# EAGLE design watchclock (EAGLE 7.2.0)
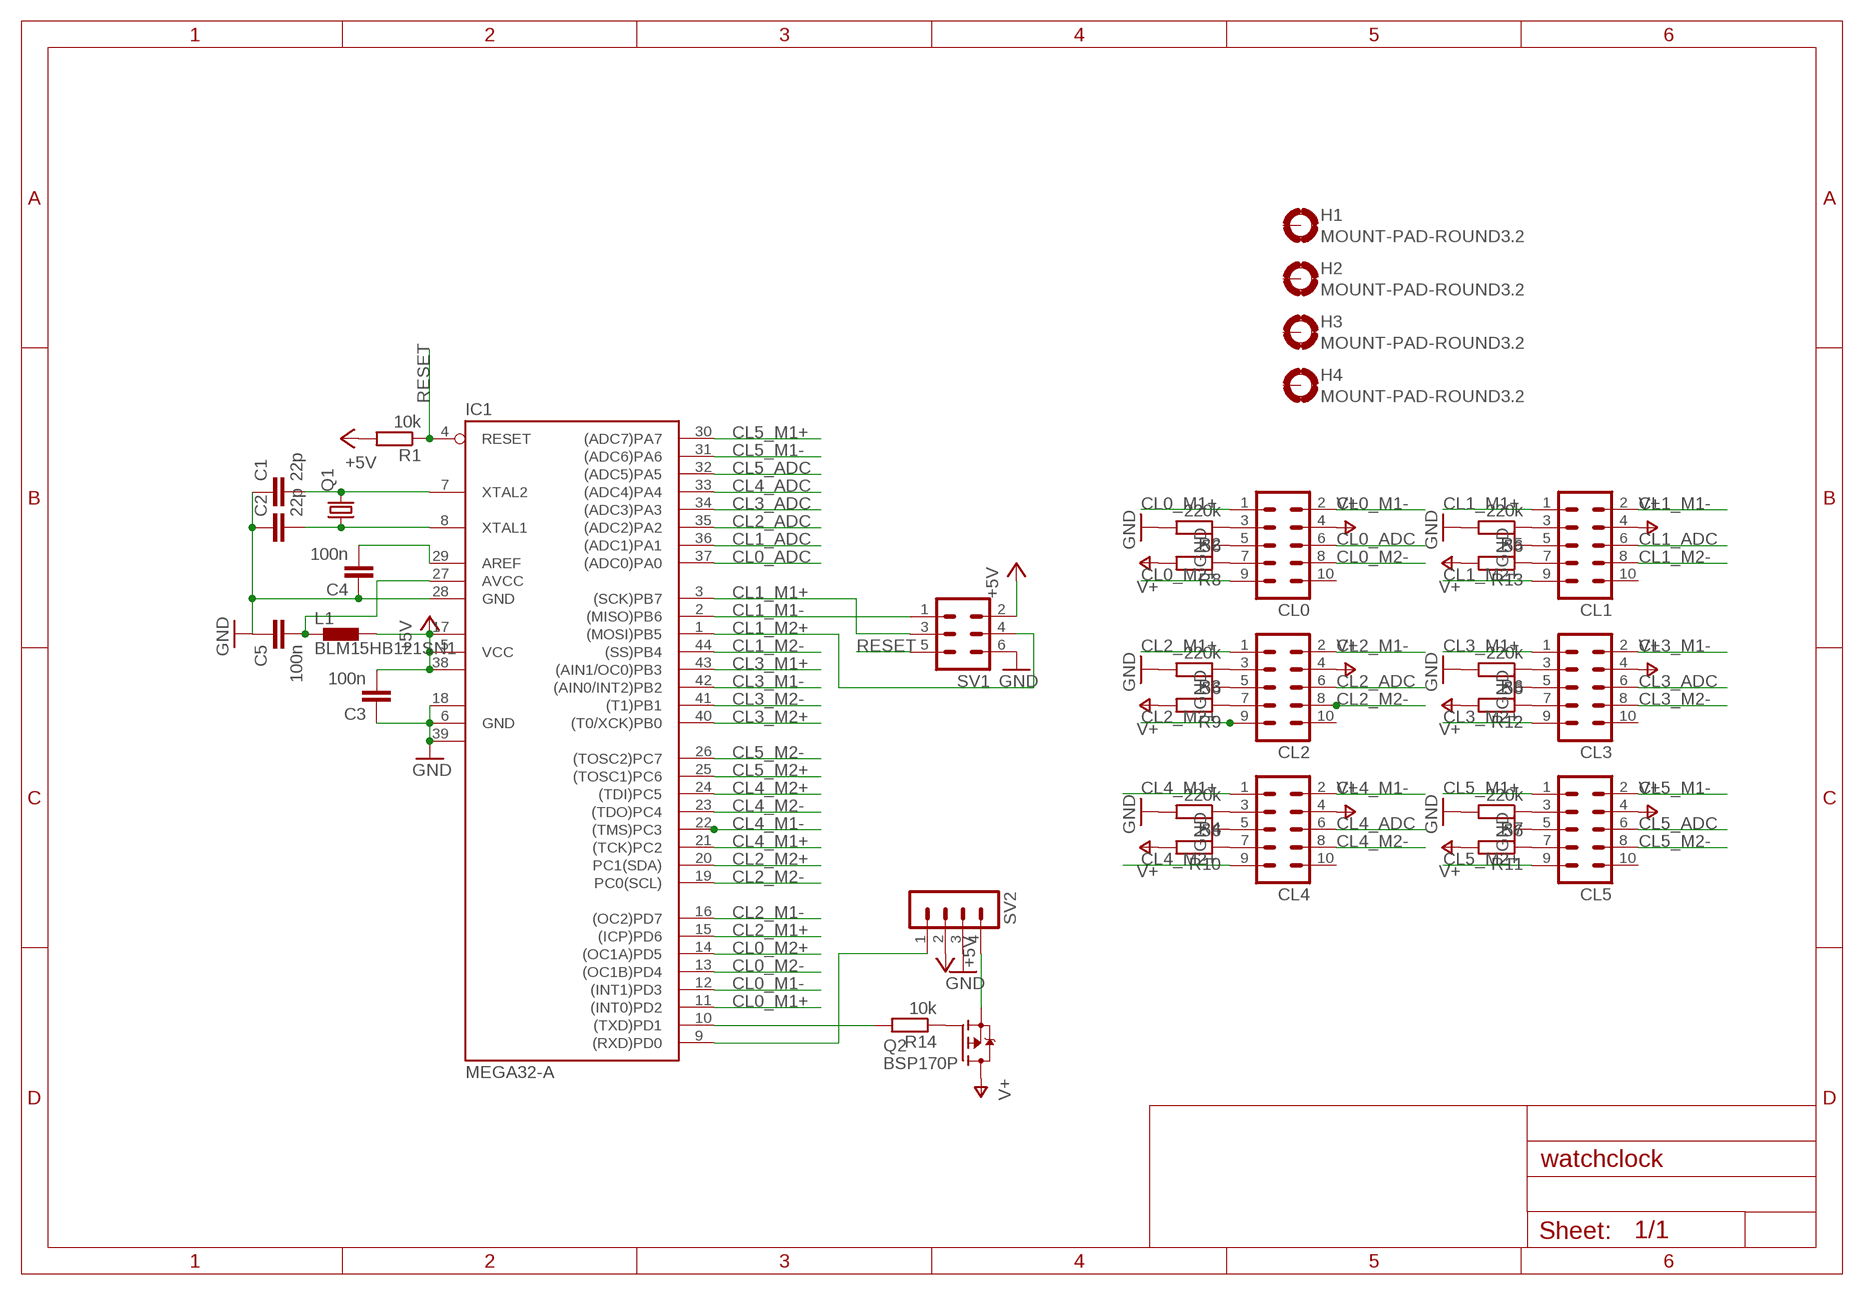
[diagram p0: schematic, sheet 1]

## Parts
C1  22p  C-EUC0805  [C0805]
C2  22p  C-EUC0805  [C0805]
C3  100n  C-EUC0805  [C0805]
C4  100n  C-EUC0805  [C0805]
C5  100n  C-EUC0805  [C0805]
CL0  ML10  [ML10]
CL1  ML10  [ML10]
CL2  ML10  [ML10]
CL3  ML10  [ML10]
CL4  ML10  [ML10]
CL5  ML10  [ML10]
H1  MOUNT-PAD-ROUND3.2  [3,2-PAD]
H2  MOUNT-PAD-ROUND3.2  [3,2-PAD]
H3  MOUNT-PAD-ROUND3.2  [3,2-PAD]
H4  MOUNT-PAD-ROUND3.2  [3,2-PAD]
IC1  MEGA32-A  [TQFP44]
L1  BLM15HB121SN1  [0402]
Q1  CRYSTALHC49S  [HC49/S]
Q2  BSP170P  [SOT223]
R1  10k  R-EU_M0805  [M0805]
R2  220k  R-EU_M0805  [M0805]
R3  220k  R-EU_M0805  [M0805]
R4  220k  R-EU_M0805  [M0805]
R5  220k  R-EU_M0805  [M0805]
R6  220k  R-EU_M0805  [M0805]
R7  220k  R-EU_M0805  [M0805]
R8  56  R-EU_M0805  [M0805]
R9  56  R-EU_M0805  [M0805]
R10  56  R-EU_M0805  [M0805]
R11  56  R-EU_M0805  [M0805]
R12  56  R-EU_M0805  [M0805]
R13  56  R-EU_M0805  [M0805]
R14  10k  R-EU_M0805  [M0805]
SV1  ML6  [ML6]
SV2  MA04-1  [MA04-1]

## Nets
+5V: C3.2 IC1.5(VCC) IC1.17(VCC1) IC1.38(VCC2) L1.2 R1.2 SV1.2 SV2.2
CL0_ADC: CL0.6 IC1.37((ADC0)PA0)
CL0_M1+: CL0.1 IC1.11((INT0)PD2)
CL0_M1-: CL0.2 IC1.12((INT1)PD3)
CL0_M2+: CL0.9 IC1.14((OC1A)PD5)
CL0_M2-: CL0.8 IC1.13((OC1B)PD4)
CL1_ADC: CL1.6 IC1.36((ADC1)PA1)
CL1_M1+: CL1.1 IC1.3((SCK)PB7) SV1.3
CL1_M1-: CL1.2 IC1.2((MISO)PB6) SV1.1
CL1_M2+: CL1.9 IC1.1((MOSI)PB5) SV1.4
CL1_M2-: CL1.8 IC1.44((SS)PB4)
CL2_ADC: CL2.6 IC1.35((ADC2)PA2)
CL2_M1+: CL2.1 IC1.15((ICP)PD6)
CL2_M1-: CL2.2 IC1.16((OC2)PD7)
CL2_M2+: CL2.9 IC1.20(PC1(SDA))
CL2_M2-: CL2.8 IC1.19(PC0(SCL))
CL3_ADC: CL3.6 IC1.34((ADC3)PA3)
CL3_M1+: CL3.1 IC1.43((AIN1/OC0)PB3)
CL3_M1-: CL3.2 IC1.42((AIN0/INT2)PB2)
CL3_M2+: CL3.9 IC1.40((T0/XCK)PB0)
CL3_M2-: CL3.8 IC1.41((T1)PB1)
CL4_ADC: CL4.6 IC1.33((ADC4)PA4)
CL4_M1+: CL4.1 IC1.21((TCK)PC2)
CL4_M1-: CL4.2 IC1.22((TMS)PC3)
CL4_M2+: CL4.9 IC1.24((TDI)PC5)
CL4_M2-: CL4.8 IC1.23((TDO)PC4)
CL5_ADC: CL5.6 IC1.32((ADC5)PA5)
CL5_M1+: CL5.1 IC1.30((ADC7)PA7)
CL5_M1-: CL5.2 IC1.31((ADC6)PA6)
CL5_M2+: CL5.9 IC1.25((TOSC1)PC6)
CL5_M2-: CL5.8 IC1.26((TOSC2)PC7)
GND: C1.1 C2.1 C3.1 C4.1 C5.1 CL0.5 CL1.5 CL2.5 CL3.5 CL4.5 CL5.5 IC1.6(GND) IC1.18(GND1) IC1.28(GND) IC1.39(GND2) R2.2 R3.2 R4.2 R5.2 R6.2 R7.2 SV1.6 SV2.3
N$1: CL0.3 R2.1
N$2: C2.2 IC1.8(XTAL1) Q1.1
N$3: C1.2 IC1.7(XTAL2) Q1.2
N$4: C4.2 IC1.29(AREF)
N$5: C5.2 IC1.27(AVCC) L1.1
N$6: CL2.3 R3.1
N$7: CL4.3 R4.1
N$8: CL1.3 R5.1
N$9: CL3.3 R6.1
N$10: CL5.3 R7.1
N$11: CL0.7 R8.1
N$12: CL2.7 R9.1
N$13: CL4.7 R10.1
N$14: CL5.7 R11.1
N$15: CL3.7 R12.1
N$16: CL1.7 R13.1
N$17: Q2.1(G) R14.1
N$18: Q2.3(S) SV2.4
N$26: IC1.10((TXD)PD1) R14.2
RESET: IC1.4(RESET) R1.1 SV1.5
RXT: IC1.9((RXD)PD0) SV2.1
V+: CL0.4 CL1.4 CL2.4 CL3.4 CL4.4 CL5.4 Q2.2(D) Q2.4(D) R8.2 R9.2 R10.2 R11.2 R12.2 R13.2
Unconnected: CL0.10 CL1.10 CL2.10 CL3.10 CL4.10 CL5.10 H1.B3,2(MOUNT) H2.B3,2(MOUNT) H3.B3,2(MOUNT) H4.B3,2(MOUNT)

## Library data of the parts
C1-C5 = resistor:C-EU: CAPACITOR, European symbol
CL0 CL1-CL5 = con-harting-ml:ML10: HARTING; OC_FARNELL: unknown; OC_NEWARK: unknown
H1-H4 = holes:MOUNT-PAD-ROUND: MOUNTING PAD, round
IC1 = atmel:MEGA32: MICROCONTROLLER 32 Kbytes FLASH 2 Kbytes SRAM 1 Kbytes EEPROM USART 8-channel 10 bit ADC Source: www.atmel.com .. doc2503.pdf; MPN: ATMEGA32-16AU; OC_FARNELL: 9171274; OC_NEWARK: 69K6677
L1 = inductors:BLM15H: EMIFIL (R) Chip Ferrite Bead for GHz Noise Source: http://www.murata.com/ Ferrite Bead BLM15H.pdf
Q1 = crystal:CRYSTAL: CRYSTAL; OC_FARNELL: 1667008; OC_NEWARK: unknown
Q2 = transistor-fet:BSP170P: SIPMOS(R) Small-Signal-Transistor P-Channel, Enhancement mode Source: http://www.infineon.com/upload/Document/BSP170P_Rev2.4.pdf
R1-R14 = resistor:R-EU_: RESISTOR, European symbol
SV1 = con-harting-ml:ML6: HARTING; OC_FARNELL: unknown; OC_NEWARK: unknown
SV2 = con-lstb:MA04-1: PIN HEADER; OC_FARNELL: unknown; OC_NEWARK: unknown

## Board
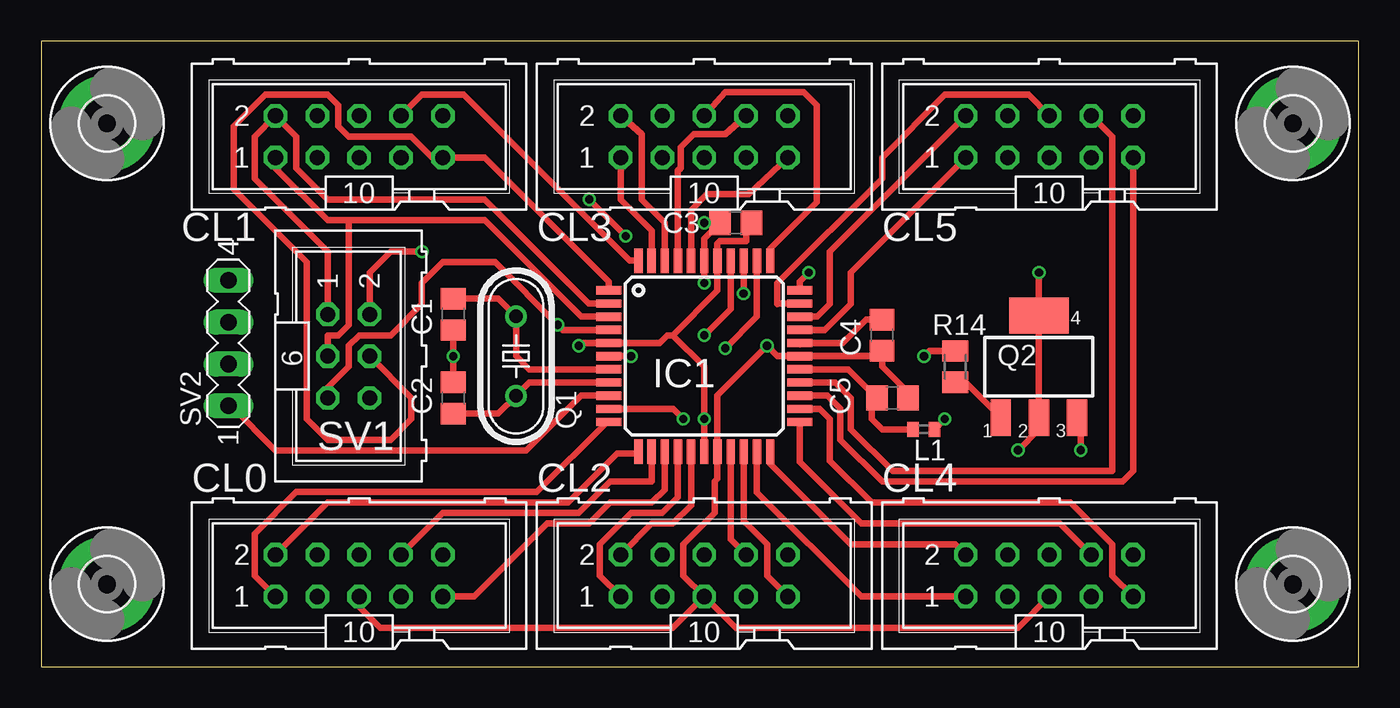
[diagram p1: board, top side]
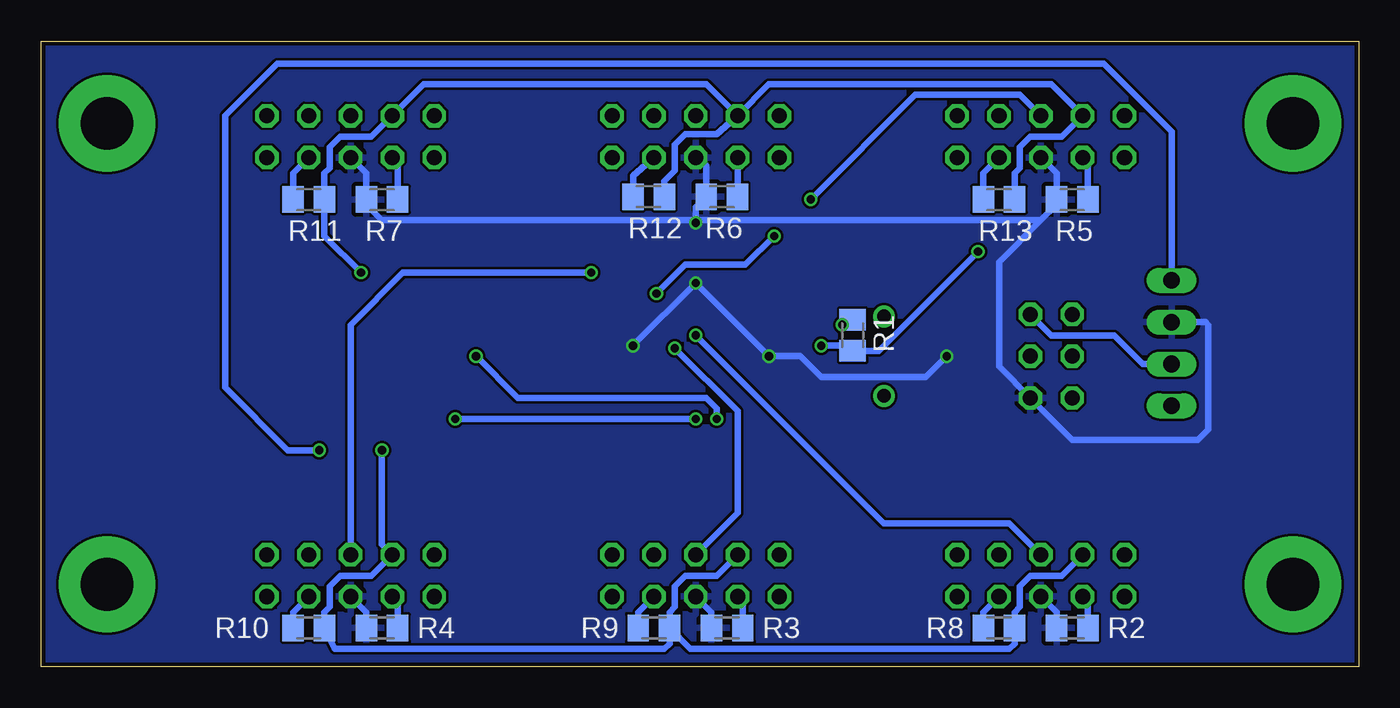
[diagram p2: board, bottom side, seen from below]

Size 80 x 38 mm. Coordinates in mm from the lower left corner, seen from the top.
Outline: 0,0 80,0 80,38 0,38 0,0
Copper layers (1*16): Top 0.035mm / dielectric 1.5mm / Bottom 0.035mm
Design rules "Elecrow_2-layer_eagle_rule": minimum track width 6mil, minimum drill 12mil, track to track 6mil, track to pad 6mil, pad to pad 6mil, via to via 6mil, smd to smd 0mil, copper to edge 10mil, drill to drill 10mil, minimum pad ring 10mil, minimum via ring 6mil, stop-mask expansion 2mil, vias tented up to drill 100mil, thermal gap 10mil

### Footprints (pad centres in the part's own frame; a part is rotated, then mirrored left to right if it is on the bottom)
C0805 = smd 1.3 x 1.5: 1 -0.95,0; 2 0.95,0
ML10 = drill 0.914 octagon: 1 -5.08,-1.27; 2 -5.08,1.27; 3 -2.54,-1.27; 4 -2.54,1.27; 5 0,-1.27; 6 0,1.27; 7 2.54,-1.27; 8 2.54,1.27; 9 5.08,-1.27; 10 5.08,1.27
3,2-PAD = drill 3.2 pad 5.842: B3,2 0,0
TQFP44 = smd 1.5 x 0.5: 1 -5.8,4; 2 -5.8,3.2; 3 -5.8,2.4; 4 -5.8,1.6; 5 -5.8,0.8; 6 -5.8,0; 7 -5.8,-0.8; 8 -5.8,-1.6; 9 -5.8,-2.4; 10 -5.8,-3.2; 11 -5.8,-4; 23 5.8,-4; 24 5.8,-3.2; 25 5.8,-2.4; 26 5.8,-1.6; 27 5.8,-0.8; 28 5.8,0; 29 5.8,0.8; 30 5.8,1.6; 31 5.8,2.4; 32 5.8,3.2; 33 5.8,4 | smd 0.5 x 1.5: 12 -4,-5.8; 13 -3.2,-5.8; 14 -2.4,-5.8; 15 -1.6,-5.8; 16 -0.8,-5.8; 17 0,-5.8; 18 0.8,-5.8; 19 1.6,-5.8; 20 2.4,-5.8; 21 3.2,-5.8; 22 4,-5.8; 34 4,5.8; 35 3.2,5.8; 36 2.4,5.8; 37 1.6,5.8; 38 0.8,5.8; 39 0,5.8; 40 -0.8,5.8; 41 -1.6,5.8; 42 -2.4,5.8; 43 -3.2,5.8; 44 -4,5.8
0402 = smd 0.7 x 0.9: 1 -0.65,0; 2 0.65,0
HC49/S = drill 0.813: 1 -2.413,0; 2 2.413,0
SOT223 = smd 1.219 x 2.235: 1 -2.311,-3.099; 2 0,-3.099; 3 2.311,-3.099 | smd 3.6 x 2.2: 4 0,3.099
M0805 = smd 1.3 x 1.6: 1 -0.95,0; 2 0.95,0
ML6 = drill 0.914 octagon: 1 -2.54,-1.27; 2 -2.54,1.27; 3 0,-1.27; 4 0,1.27; 5 2.54,-1.27; 6 2.54,1.27
MA04-1 = drill 1.016 long: 1 -3.81,0; 2 -1.27,0; 3 1.27,0; 4 3.81,0

### Placement (x,y rotation side)
C1  25.02,21.4 90 top
C2  25.02,16.32 270 top
C3  42.16,26.96 0 top
C4  51.05,20.13 90 top
C5  51.69,16.32 180 top
CL0  19.3,5.53 0 top
CL1  19.3,32.2 0 top
CL2  40.26,5.53 0 top
CL3  40.26,32.2 0 top
CL4  61.22,5.53 0 top
CL5  61.22,32.2 0 top
H1  4,5 0 top
H2  76,5 0 top
H3  4,33 0 top
H4  76,33 0 top
IC1  40.26,18.86 0 top
L1  53.59,14.41 0 top
Q1  28.83,18.86 90 top
Q2  60.58,18.23 0 top
R1  30.73,20.13 270 bottom
R2  17.4,2.35 180 bottom
R3  38.35,2.35 180 bottom
R4  59.31,2.35 180 bottom
R5  17.4,28.38 180 bottom
R6  38.67,28.54 180 bottom
R7  59.31,28.38 180 bottom
R8  21.84,2.35 0 bottom
R9  42.8,2.35 0 bottom
R10  63.75,2.35 0 bottom
R11  63.75,28.38 0 bottom
R12  43.12,28.54 0 bottom
R13  21.84,28.38 0 bottom
R14  55.5,18.23 90 top
SV1  18.67,18.86 270 top
SV2  11.37,19.65 90 top

### Tracks (layer width: path | path; a pad name or v marks a point on that pad's centre or on a via)
+5V  (via drill 0.5)
  Top 0.406: 38.35,20.13 41.06,22.84 IC1.38 41.06,25.69 41.21,25.84 42.8,25.84 42.8,26.64 C3.2 | 38.35,20.13 38.02,20.13 37.55,19.66 IC1.5 32.8,19.66 v32.64,19.5 | IC1.17 v40.26,15.05 40.26,18.23 38.35,20.13 | v54.87,15.05 54.87,15.04 L1.2 | v23.11,25.21 21.21,25.21 19.94,23.94 SV1.2
  Bottom 0.406: v40.26,15.05 v54.87,15.05 | v32.64,19.5 31.05,19.5 R1.2 29.15,19.18 v23.11,25.21 | SV2.2 13.11,18.38 14.86,20.13 18.67,20.13 SV1.2
CL0_ADC  (via drill 0.5)
  Top 0.406: IC1.37 41.86,21.73 v40.26,20.13
  Bottom 0.406: v40.26,20.13 28.83,8.7 21.21,8.7 CL0.6
CL0_M1+
  Top 0.406: IC1.11 34.35,14.86 30.1,10.61 15.5,10.61 12.95,8.06 12.95,5.53 CL0.1
CL0_M1-
  Top 0.406: CL0.2 17.4,9.97 32.01,9.97 34.99,12.95 36.26,12.95 IC1.12
CL0_M2+
  Top 0.406: CL0.9 26.29,4.26 30.73,8.7 33.27,8.7 34.55,9.97 37.09,9.97 37.86,10.74 IC1.14
CL0_M2-
  Top 0.406: CL0.8 24.38,9.34 32.64,9.34 34.55,11.24 37.09,11.24 37.06,11.27 IC1.13
CL1_ADC  (via drill 0.5)
  Top 0.406: v42.64,22.67 42.64,24.64 IC1.36 | v35.5,26.16 v33.27,28.38
  Bottom 0.406: v42.64,22.67 40.9,24.42 37.24,24.42 v35.5,26.16 | CL1.6 20.57,34.73 26.92,34.73 v33.27,28.38
CL1_M1+
  Top 0.406: IC1.3 32.78,21.26 26.92,27.11 18.67,27.11 | 18.67,27.11 17.4,27.11 14.23,30.29 CL1.1 | SV1.3 17.4,20.13 18.04,20.13 18.67,20.77 18.67,27.11
CL1_M1-
  Top 0.406: IC1.2 33.25,22.06 26.92,28.38 17.4,28.38 15.5,30.29 15.5,32.2 CL1.2 12.95,32.2 12.95,29.66 17.4,25.21 SV1.1
CL1_M2+
  Top 0.406: IC1.1 34.46,23.39 26.92,30.92 CL1.9 23.75,30.92 22.48,32.2 18.67,32.2 18.04,32.83 18.04,34.1 17.4,34.73 13.59,34.73 11.68,32.83 11.68,29.02 16.13,24.57 16.13,15.05 17.4,13.78 21.21,13.78 22.48,15.05 22.48,16.32 SV1.4
CL1_M2-
  Top 0.406: IC1.44 35.73,24.66 25.66,34.73 23.11,34.73 CL1.8
CL2_ADC  (via drill 0.5)
  Top 0.406: IC1.35 43.46,21.27 v41.53,19.34
  Bottom 0.406: CL2.6 37.72,9.34 37.72,15.53 v41.53,19.34
CL2_M1+
  Top 0.406: IC1.15 38.66,10.28 37.72,9.34 35.81,9.34 33.91,7.43 33.91,5.53 CL2.1
CL2_M1-
  Top 0.406: IC1.16 39.46,9.8 38.35,8.7 37.09,8.7 CL2.2
CL2_M2+
  Top 0.406: IC1.20 42.66,8.84 44.07,7.43 44.07,5.53 CL2.9
CL2_M2-
  Top 0.406: IC1.19 41.86,7.73 CL2.8
CL3_ADC
  Top 0.406: IC1.34 44.26,25.4 47.09,28.23 47.09,34.1 46.29,34.89 41.53,34.89 CL3.6
CL3_M1+
  Top 0.406: CL3.1 35.18,28.38 37.06,26.5 IC1.43
CL3_M1-
  Top 0.406: CL3.2 36.45,32.35 36.45,28.38 37.86,26.98 IC1.42
CL3_M2+
  Top 0.406: IC1.40 39.46,27.74 40.42,28.7 42.96,28.7 CL3.9
CL3_M2-
  Top 0.406: IC1.41 38.66,30.12 38.83,30.29 38.83,31.56 39.62,32.35 41.53,32.35 CL3.8
CL4_ADC  (via drill 0.5)
  Top 0.406: IC1.33 46.06,23.39 v46.61,23.94
  Bottom 0.406: v46.61,23.94 58.04,23.94 61.22,20.77 CL4.6
CL4_M1+
  Top 0.406: CL4.1 49.78,4.26 43.46,10.58 IC1.21
CL4_M1-
  Top 0.406: CL4.2 55.5,7.43 49.15,7.43 44.26,12.32 IC1.22
CL4_M2+
  Top 0.406: CL4.9 65.03,5.53 65.03,7.43 62.48,9.97 50.42,9.97 47.88,12.51 47.88,15.05 47.27,15.66 IC1.24
CL4_M2-
  Top 0.406: IC1.23 46.06,12.43 49.78,8.7 61.85,8.7 CL4.8
CL5_ADC
  Top 0.406: IC1.32 44.73,22.06 44.7,22.04 44.7,23.3 51.05,29.66 51.05,30.92 54.87,34.73 59.94,34.73 CL5.6
CL5_M1+
  Top 0.406: IC1.30 47.58,20.46 49.15,22.04 49.15,23.94 CL5.1
CL5_M1-
  Top 0.406: IC1.31 47.1,21.26 47.88,22.04 47.88,25.21 CL5.2
CL5_M2+
  Top 0.406: IC1.25 47.74,16.46 48.52,15.68 48.52,13.78 51.05,11.24 65.66,11.24 66.3,11.88 CL5.9
CL5_M2-
  Top 0.406: IC1.26 48.21,17.26 49.15,16.32 49.15,14.41 51.69,11.88 65.03,11.88 65.03,32.2 CL5.8
GND  (via drill 0.5)
  Top 0.406: C1.1 v25.02,18.86 C2.1 | IC1.6 v35.81,18.86 | v40.26,23.3 IC1.39 40.26,26 C3.1 v40.26,26.96 | CL2.5 38.99,5.53 38.99,7.43 40.9,9.34 40.9,11.24 41.06,11.4 IC1.18 41.06,16.48 v44.07,19.5 44.7,18.86 IC1.28 50.73,18.86 C4.1 51.05,18.23 52.33,16.95 52.33,16.64 C5.1 | CL0.5 19.3,3.62 20.57,2.35 38.35,2.35 CL2.5 | CL4.5 59.31,2.35 42.16,2.35 CL2.5
  Bottom 0.406: v44.07,19.5 v40.26,23.3 v35.81,18.86 33.91,18.86 32.64,17.59 26.29,17.59 v25.02,18.86 | CL1.5 18.35,29.97 R5.2 18.35,28.07 19.3,27.11 | CL5.5 60.26,29.97 R7.2 60.26,28.06 59.31,27.11 40.42,27.11 v40.26,26.96 | R4.2 60.26,3.3 CL4.5 | R3.2 39.3,3.3 CL2.5 | R2.2 18.35,3.3 CL0.5 | CL3.5 39.62,30.45 R6.2 40.26,27.91 v40.26,26.96 | 19.3,27.11 40.1,27.11 v40.26,26.96 | 19.3,27.11 21.84,24.57 21.84,18.23 SV1.6 17.4,13.78 9.78,13.78 9.14,14.41 9.14,20.77 | SV2.3 9.3,20.92
  pour Bottom: -0.38,37.91 80.27,37.91 80.27,-0.19 -0.38,-0.19
N$1
  Bottom 0.406: R2.1 16.45,3.94 CL0.3
N$2
  Top 0.406: IC1.8 29.64,17.26 Q1.1 27.75,15.37 C2.2
N$3
  Top 0.406: IC1.7 29.63,18.06 28.83,18.86 Q1.2 27.75,22.35 C1.2
N$4
  Top 0.406: C4.2 50.1,21.08 48.68,19.66 IC1.29 46.06,19.58
N$5
  Top 0.406: IC1.27 49,18.06 C5.2 50.42,16 50.42,15.05 51.05,14.41 L1.1
N$6
  Bottom 0.406: R3.1 37.41,3.94 CL2.3
N$7
  Bottom 0.406: R4.1 58.36,3.94 CL4.3
N$8
  Bottom 0.406: R5.1 16.45,30.61 CL1.3
N$9
  Bottom 0.406: R6.1 37.72,30.77 CL3.3
N$10
  Bottom 0.406: R7.1 58.36,30.61 CL5.3
N$11
  Bottom 0.406: R8.1 22.8,3.3 CL0.7
N$12
  Bottom 0.406: R9.1 43.75,3.3 CL2.7
N$13
  Bottom 0.406: R10.1 64.7,3.3 CL4.7
N$14
  Bottom 0.406: R11.1 64.7,29.98 CL5.7
N$15
  Bottom 0.406: R12.1 44.07,29.82 CL3.7
N$16
  Bottom 0.406: R13.1 22.8,29.98 CL1.7
N$17
  Top 0.406: R14.1 56.12,17.27 Q2.1
N$18  (via drill 0.5)
  Top 0.406: v63.12,13.14 63.12,14.9 Q2.3
  Bottom 0.406: SV2.4 11.37,32.51 15.5,36.64 65.66,36.64 68.83,33.47 68.83,16.95 65.03,13.14 v63.12,13.14
N$26  (via drill 0.5)
  Top 0.406: IC1.10 38.38,15.66 v38.99,15.05 | R14.2 53.91,19.18 v53.59,18.86
  Bottom 0.406: v38.99,15.05 38.99,15.68 39.62,16.32 51.05,16.32 v53.59,18.86
RESET  (via drill 0.5)
  Top 0.406: IC1.4 31.67,20.46 v31.37,20.77 27.56,24.57 24.38,24.57 23.11,23.3 23.11,22.04 21.21,20.13 19.3,20.13 18.67,19.5 18.67,18.23 17.4,16.95 SV1.5
  Bottom 0.406: v31.37,20.77 31.05,20.77 R1.1
RXT
  Top 0.406: SV2.1 11.53,15.84 14.23,13.14 29.47,13.14 32.78,16.46 IC1.9
V+  (via drill 0.5)
  Top 0.406: v60.58,23.94 Q2.4 Q2.2 60.58,14.41 v59.31,13.14
  Bottom 0.406: R13.2 20.89,29.97 20.57,30.29 20.57,31.56 19.94,32.2 18.04,32.2 CL1.4 18.67,35.37 35.81,35.37 CL3.4 | R12.2 42.17,29.49 41.53,30.13 41.53,31.72 40.9,32.35 38.99,32.35 CL3.4 | R9.2 41.85,3.3 41.53,3.62 41.53,4.89 40.9,5.53 38.99,5.53 CL2.4 | CL0.4 18.04,5.53 19.94,5.53 20.57,4.89 20.57,3.62 20.89,3.3 R8.2 20.89,1.39 21.21,1.08 40.58,1.08 R9.2 | R9.2 41.85,1.39 42.16,1.08 62.17,1.08 R10.2 62.81,3.3 62.48,3.62 62.48,4.89 61.85,5.53 59.94,5.53 CL4.4 59.31,7.43 v59.31,13.14 | CL3.4 39.62,35.37 56.77,35.37 CL5.4 59.94,32.2 61.85,32.2 62.48,31.56 62.48,30.29 62.81,29.97 R11.2 62.81,26.16 v60.58,23.94